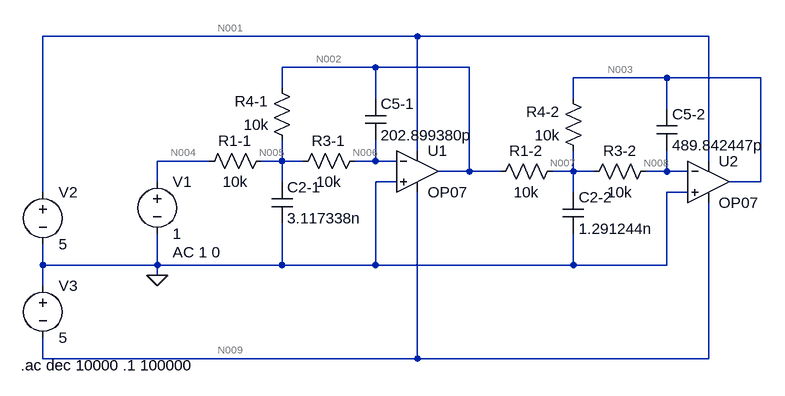
[diagram p0: schematic MultiFeedbackOrder4.asc]
MultiFeedbackOrder4.asc, the LTspice schematic file:
Version 4
SHEET 1 880 680
WIRE 176 -32 -400 -32
WIRE 624 -32 176 -32
WIRE 112 16 -32 16
WIRE 256 16 112 16
WIRE 560 32 416 32
WIRE 704 32 560 32
WIRE -32 48 -32 16
WIRE 112 64 112 16
WIRE 416 64 416 32
WIRE 560 80 560 32
WIRE 176 144 176 -32
WIRE -144 160 -224 160
WIRE -32 160 -32 128
WIRE -32 160 -64 160
WIRE 0 160 -32 160
WIRE 112 160 112 128
WIRE 112 160 80 160
WIRE 144 160 112 160
WIRE 624 160 624 -32
WIRE 256 176 256 16
WIRE 256 176 208 176
WIRE 304 176 256 176
WIRE 416 176 416 144
WIRE 416 176 384 176
WIRE 448 176 416 176
WIRE 560 176 560 144
WIRE 560 176 528 176
WIRE 592 176 560 176
WIRE -224 192 -224 160
WIRE -32 192 -32 160
WIRE 144 192 112 192
WIRE 704 192 704 32
WIRE 704 192 656 192
WIRE -400 208 -400 -32
WIRE 416 208 416 176
WIRE 592 208 560 208
WIRE -400 320 -400 288
WIRE -224 320 -224 272
WIRE -224 320 -400 320
WIRE -32 320 -32 256
WIRE -32 320 -224 320
WIRE 112 320 112 192
WIRE 112 320 -32 320
WIRE 416 320 416 272
WIRE 416 320 112 320
WIRE 560 320 560 208
WIRE 560 320 416 320
WIRE -224 336 -224 320
WIRE -400 352 -400 320
WIRE -400 464 -400 432
WIRE 176 464 176 208
WIRE 176 464 -400 464
WIRE 624 464 624 224
WIRE 624 464 176 464
FLAG -224 336 0
SYMBOL Opamps\\OP07 176 112 R0
SYMATTR InstName U1
SYMBOL res 96 144 R90
WINDOW 0 0 56 VBottom 2
WINDOW 3 32 56 VTop 2
SYMATTR InstName R3-1
SYMATTR Value 10k
SYMBOL res -48 144 R90
WINDOW 0 0 56 VBottom 2
WINDOW 3 32 56 VTop 2
SYMATTR InstName R1-1
SYMATTR Value 10k
SYMBOL res -16 144 R180
WINDOW 0 36 76 Left 2
WINDOW 3 36 40 Left 2
SYMATTR InstName R4-1
SYMATTR Value 10k
SYMBOL cap -48 192 R0
SYMATTR InstName C2-1
SYMATTR Value 3.117338n
SYMBOL cap 96 64 R0
SYMATTR InstName C5-1
SYMATTR Value 202.899380p
SYMBOL voltage -224 176 R0
WINDOW 123 24 124 Left 2
WINDOW 39 0 0 Left 2
SYMATTR InstName V1
SYMATTR Value 1
SYMATTR Value2 AC 1 0
SYMBOL Opamps\\OP07 624 128 R0
SYMATTR InstName U2
SYMBOL res 544 160 R90
WINDOW 0 0 56 VBottom 2
WINDOW 3 32 56 VTop 2
SYMATTR InstName R3-2
SYMATTR Value 10k
SYMBOL res 400 160 R90
WINDOW 0 0 56 VBottom 2
WINDOW 3 32 56 VTop 2
SYMATTR InstName R1-2
SYMATTR Value 10k
SYMBOL res 432 160 R180
WINDOW 0 36 76 Left 2
WINDOW 3 36 40 Left 2
SYMATTR InstName R4-2
SYMATTR Value 10k
SYMBOL cap 400 208 R0
SYMATTR InstName C2-2
SYMATTR Value 1.291244n
SYMBOL cap 544 80 R0
SYMATTR InstName C5-2
SYMATTR Value 489.842447p
SYMBOL voltage -400 192 R0
SYMATTR InstName V2
SYMATTR Value 5
SYMBOL voltage -400 336 R0
SYMATTR InstName V3
SYMATTR Value 5
TEXT -434 474 Left 2 !.ac dec 10000 .1 100000

The netlist it stands for:
* MultiFeedbackOrder4.asc
XU1 0 N006 N001 N009 N002 LT1001  ; OP07, pins In+ In- V+ V- OUT
R3-1 N006 N005 10k
R1-1 N005 N004 10k
R4-1 N005 N002 10k
C2-1 N005 0 3.117338n
C5-1 N002 N006 202.899380p
V1 N004 0 1 AC 1 0
XU2 0 N008 N001 N009 N003 LT1001  ; OP07, pins In+ In- V+ V- OUT
R3-2 N008 N007 10k
R1-2 N007 N002 10k
R4-2 N007 N003 10k
C2-2 N007 0 1.291244n
C5-2 N003 N008 489.842447p
V2 N001 0 5
V3 0 N009 5
.ac dec 10000 .1 100000
.lib LTC.lib
.backanno
.end

* Results of the author's LTspice run, read from the files saved beside the schematic
* Operating Point, zero values left out:
*   V(n006) = 1.349 µV
*   V(n001) = 5 V
*   V(n009) = -5 V
*   V(n002) = -1 V
*   V(n005) = 1.349 µV
*   V(n004) = 1 V
*   V(n008) = -1.344 µV
*   V(n003) = 1 V
*   V(n007) = -1.345 µV
*   I(R4-2) = -100 µA
*   I(R1-2) = 100 µA
*   I(R4-1) = 100 µA
*   I(R1-1) = -100 µA
*   I(V3) = -4.551 mA
*   I(V2) = -4.451 mA
*   I(V1) = -100 µA
*   Ix(u1:3) = 2.151 mA
*   Ix(u1:4) = -2.351 mA
*   Ix(u1:5) = 200 µA
*   Ix(u2:3) = 2.3 mA
*   Ix(u2:4) = -2.2 mA
*   Ix(u2:5) = -100 µA